# Altium schematic sheet 0118_ISH PULL UPS.SchDoc
size 848 x 558 mm
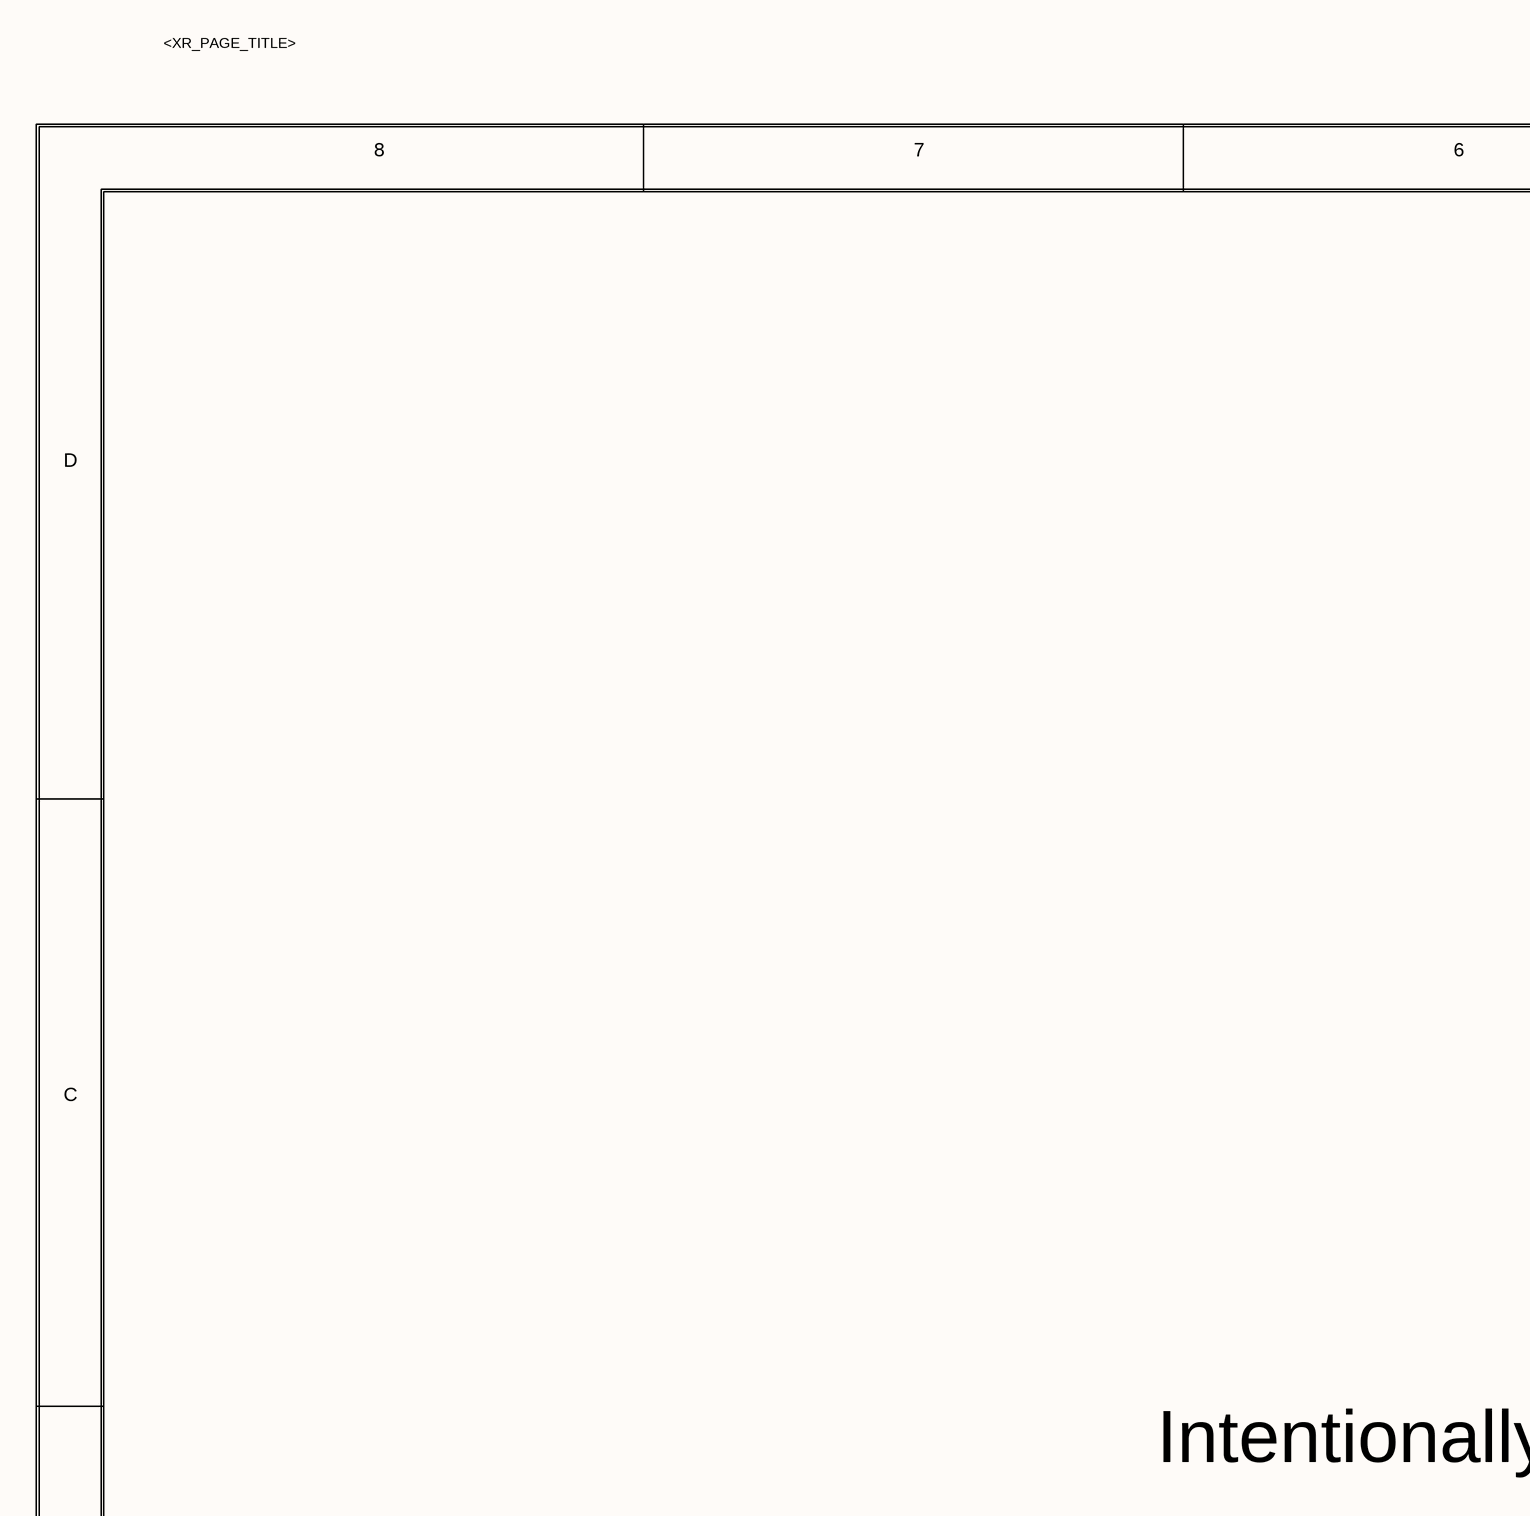
[diagram p0: 0118_ISH PULL UPS.SchDoc, top left]
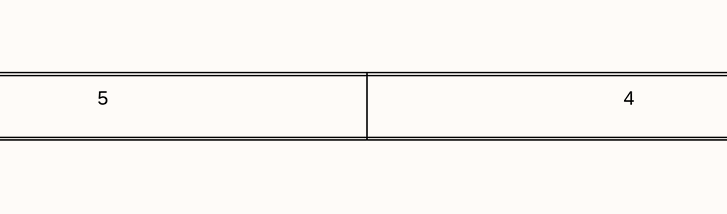
[diagram p1: 0118_ISH PULL UPS.SchDoc, top middle]
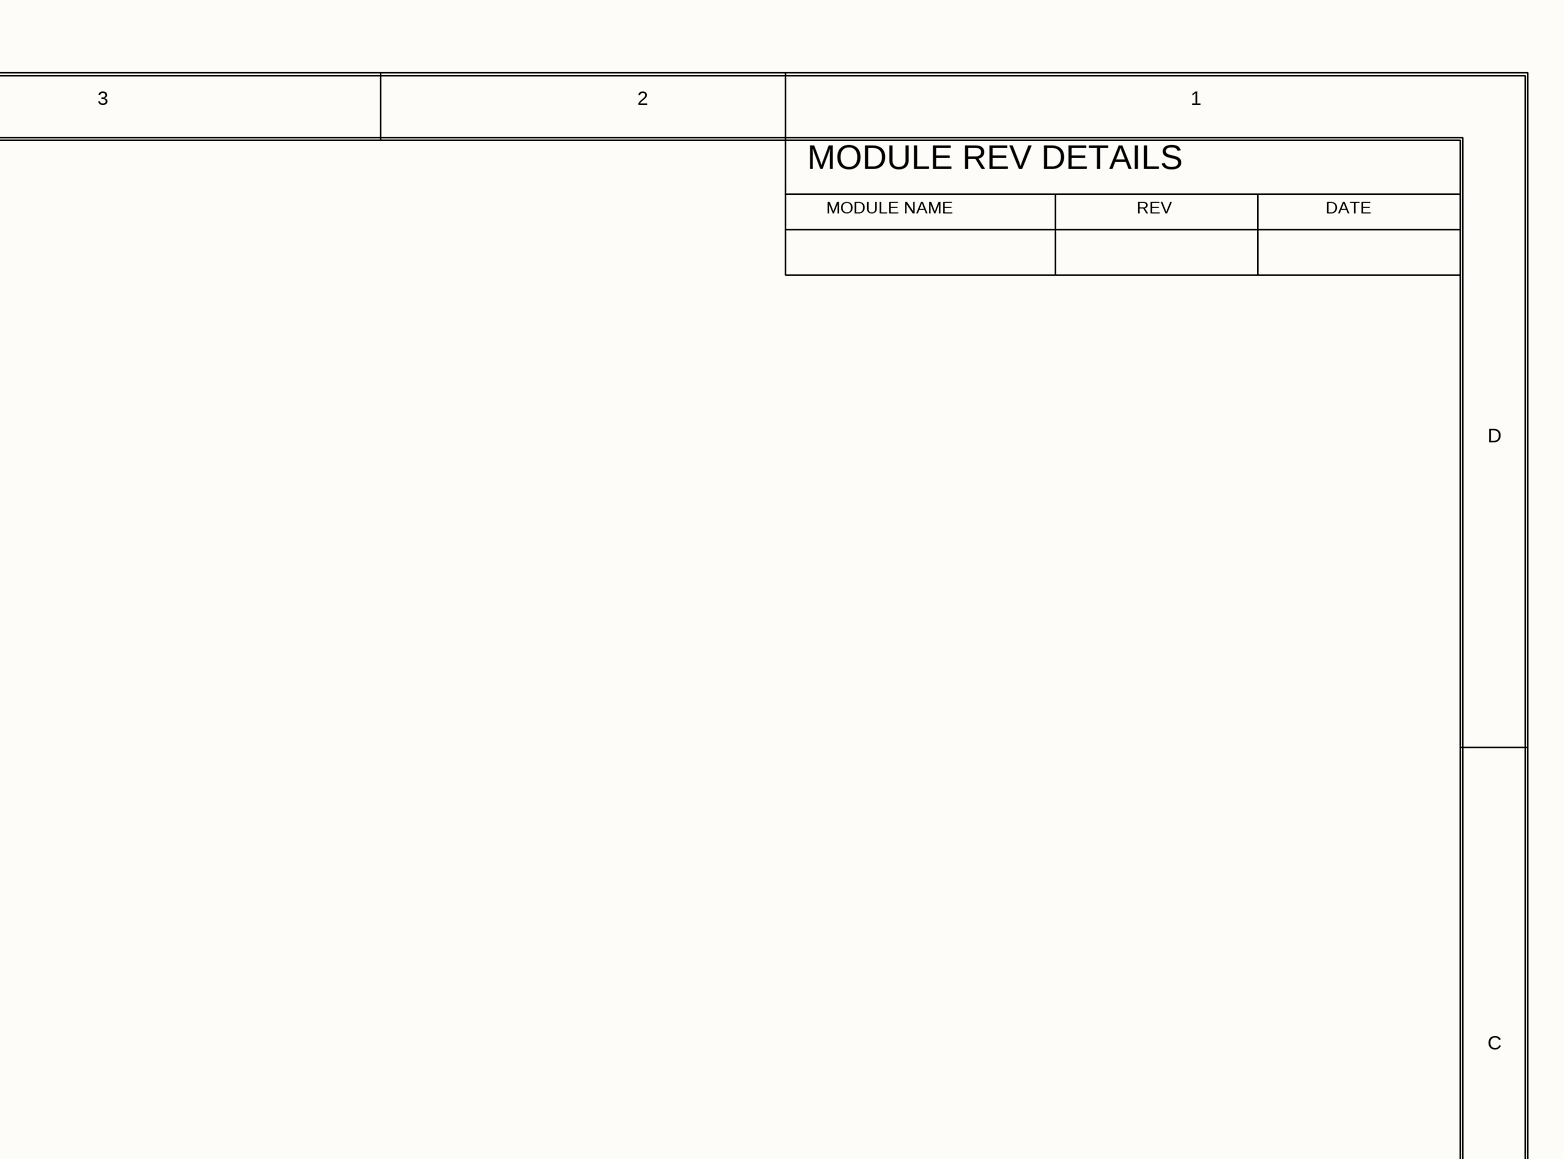
[diagram p2: 0118_ISH PULL UPS.SchDoc, top right]
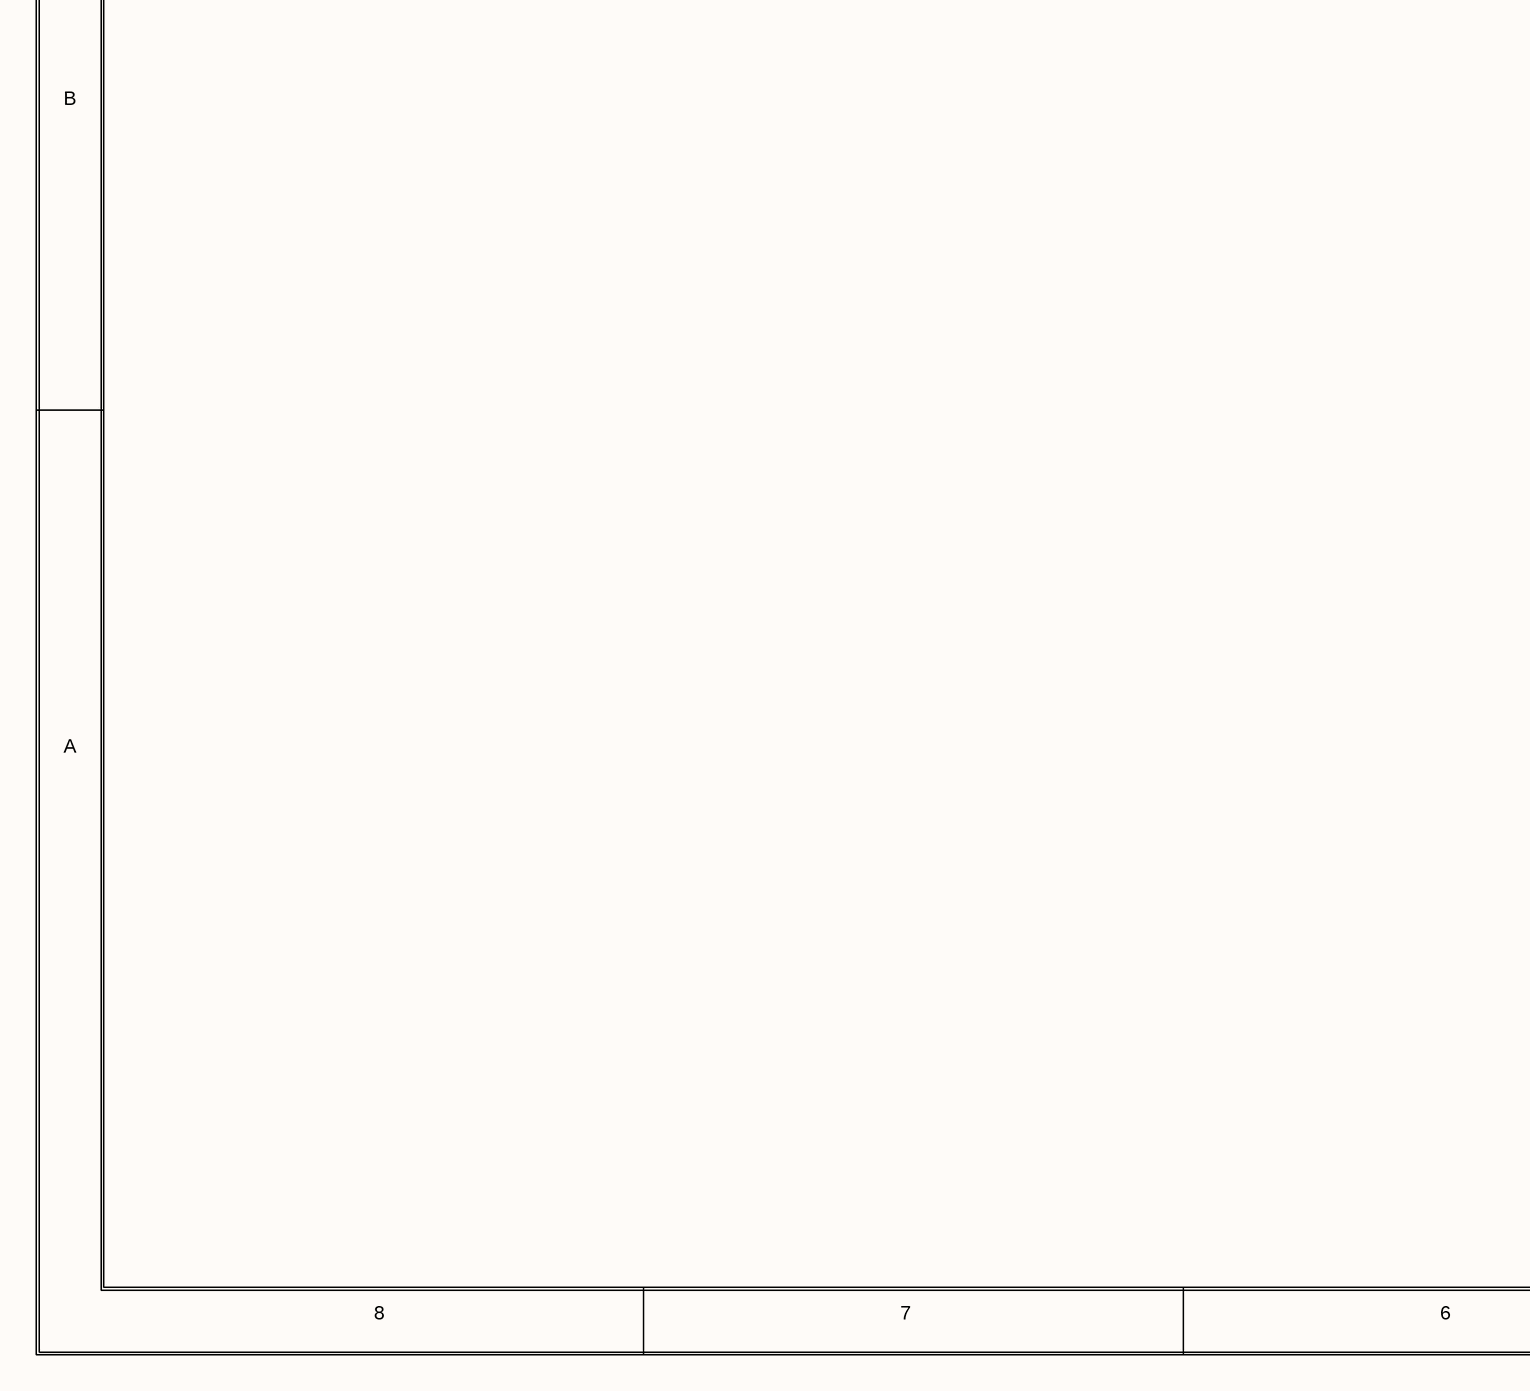
[diagram p3: 0118_ISH PULL UPS.SchDoc, bottom left]
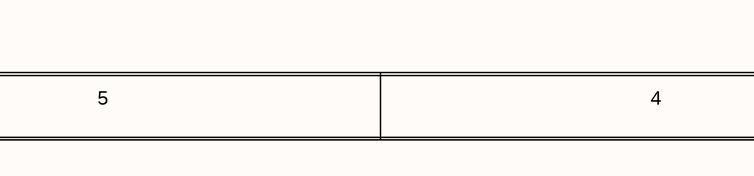
[diagram p4: 0118_ISH PULL UPS.SchDoc, bottom middle]
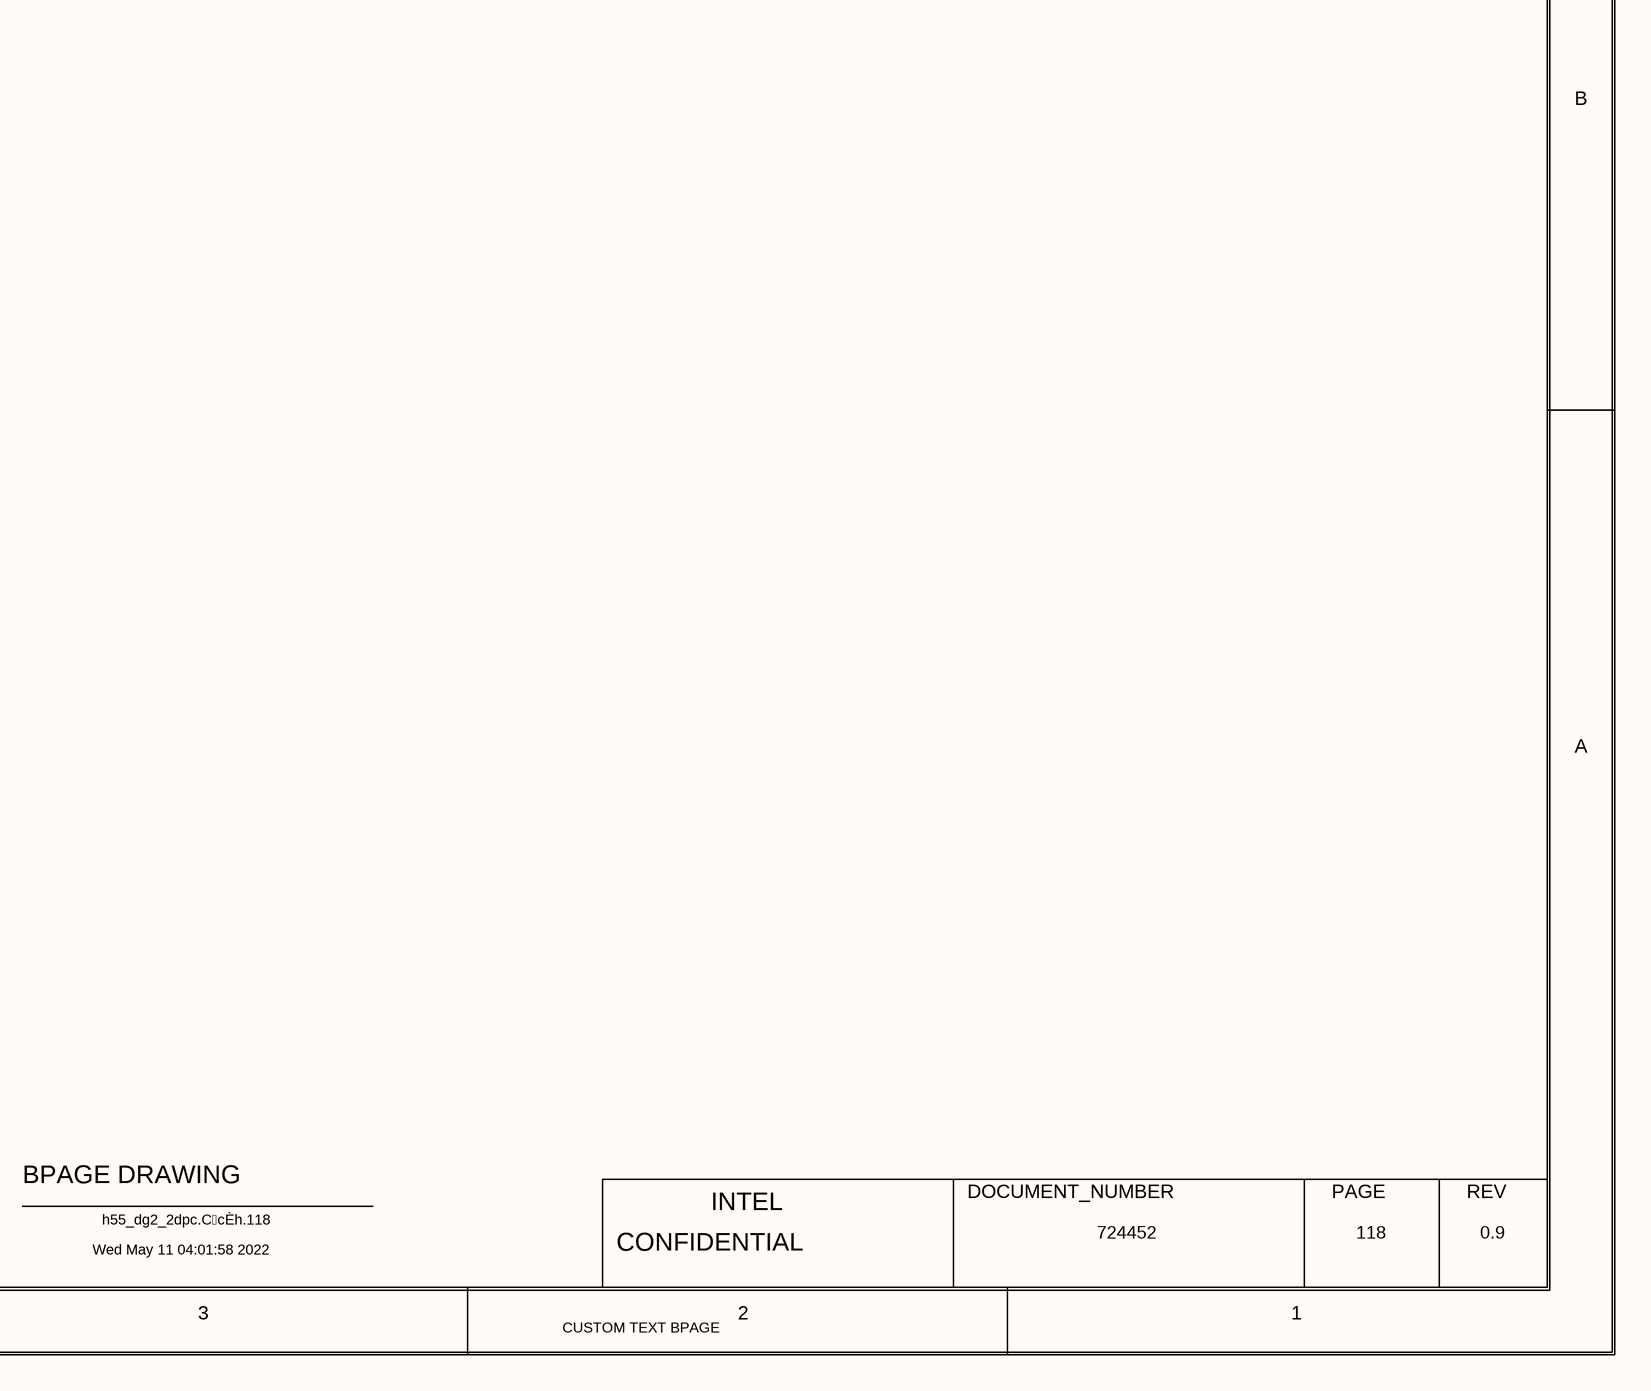
[diagram p5: 0118_ISH PULL UPS.SchDoc, bottom right]

## Notes on the sheet
- <XR_PAGE_TITLE>
- 8
- 7
- 6
- 5
- 4
- 3
- 2
- 1
- MODULE REV DETAILS
- MODULE NAME
- REV
- DATE
- D
- C
- Intentionally Left Blank
- B
- A
- BPAGE DRAWING
- INTEL
- DOCUMENT_NUMBER
- PAGE
- Wed May 11 04:01:58 2022
- h55_dg2_2dpc.CcÈh.118
- CONFIDENTIAL
- 724452
- 118
- 0.9
- CUSTOM TEXT BPAGE